# EAGLE design 618_can_switch (EAGLE 9.5.1)
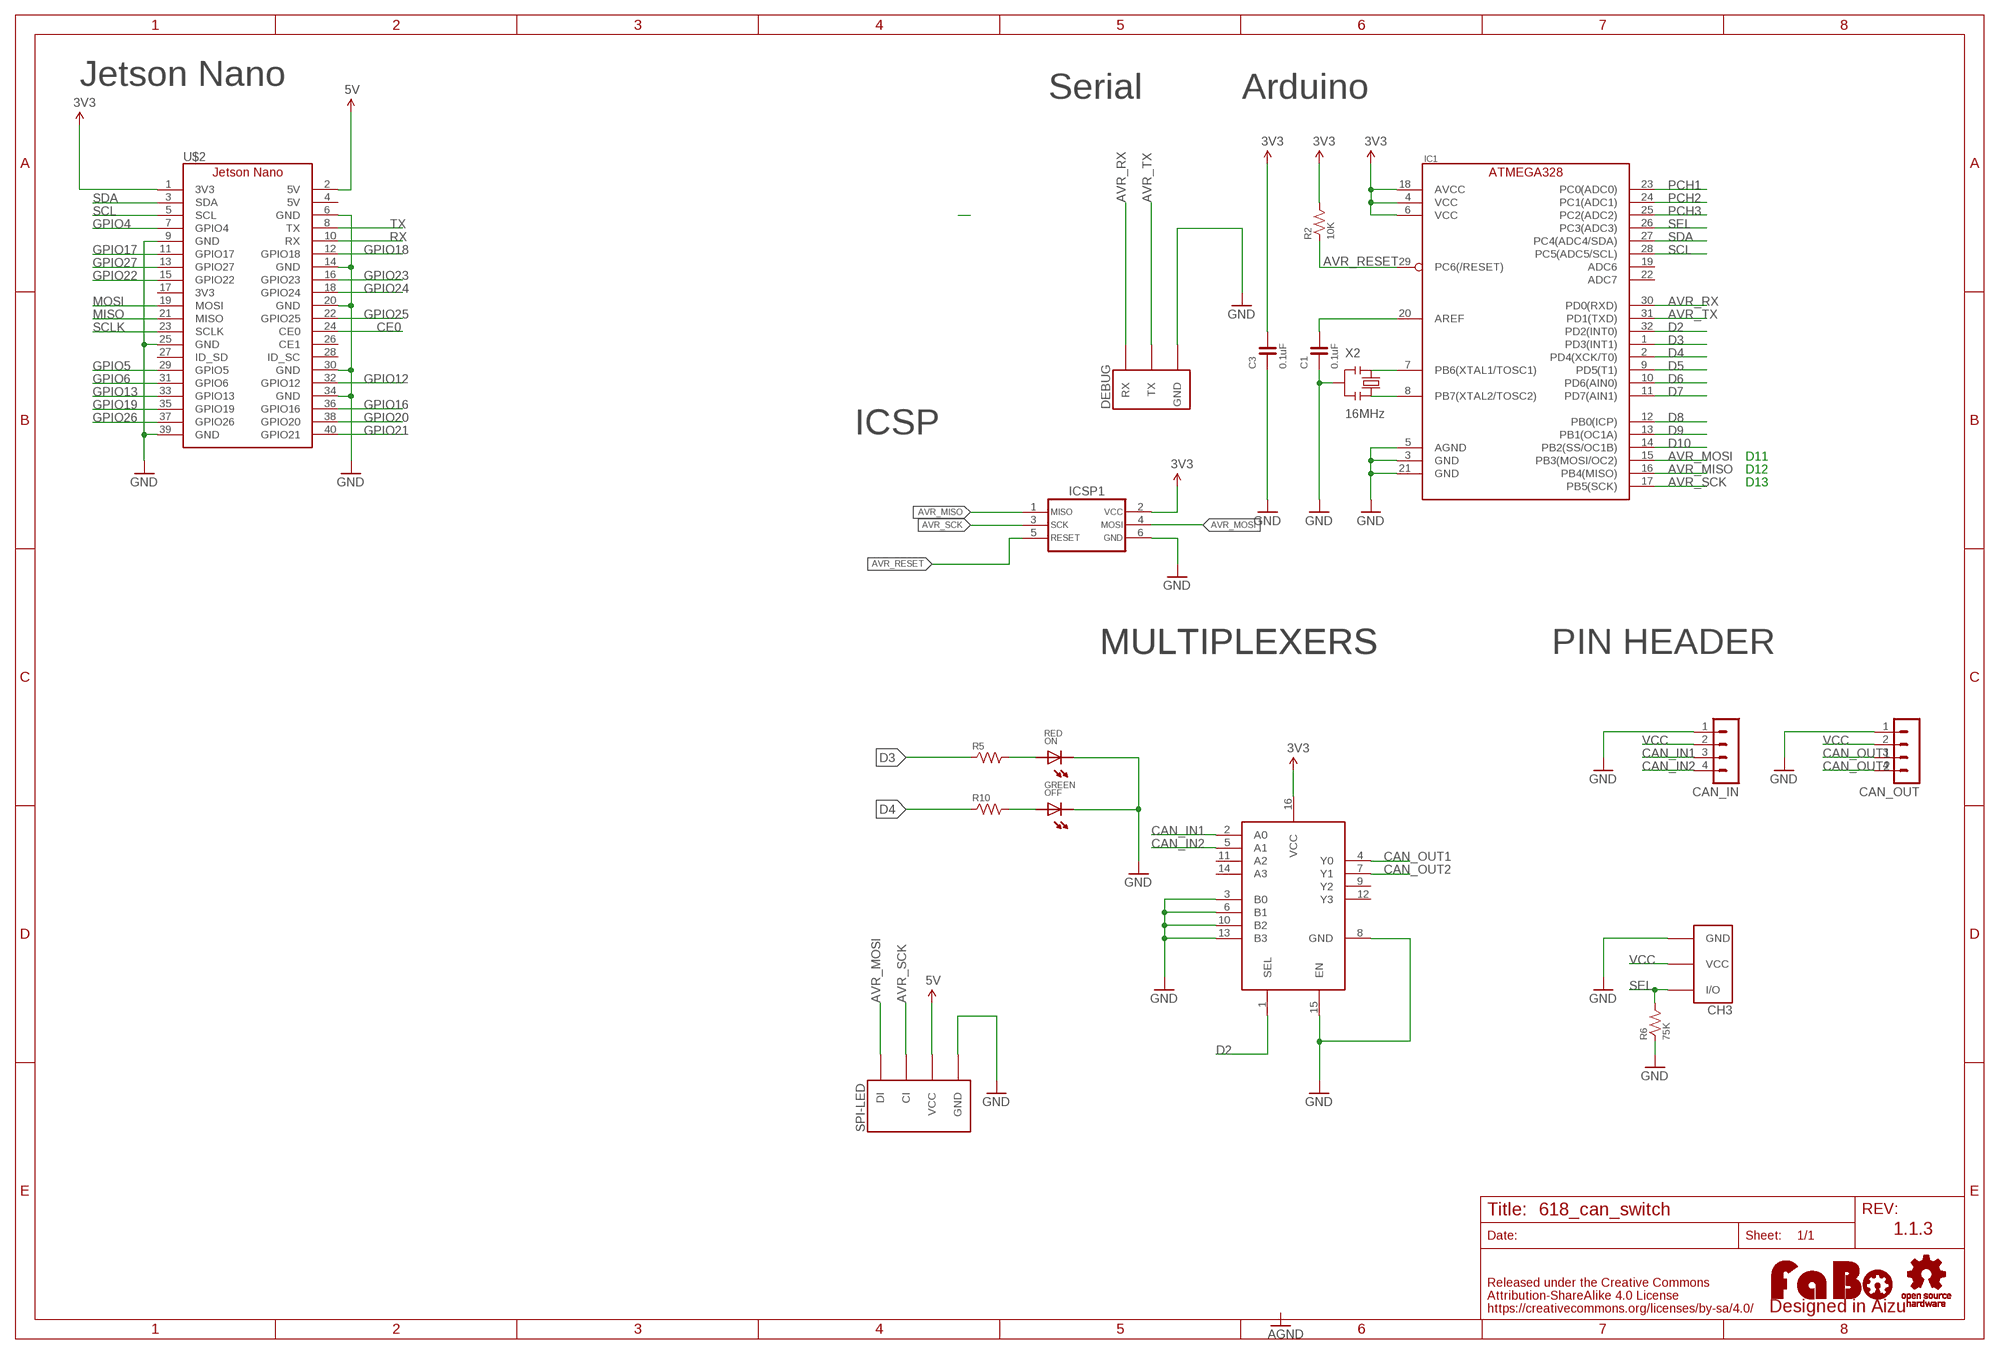
[diagram p0: schematic, sheet 1]

## Parts
C1  0.1uF  CAPACITOR-0603  [0603]
C3  0.1uF  CAPACITOR-0603  [0603]
CAN_IN  MA04-1  [MA04-1]
CAN_OUT  MA04-1  [MA04-1]
CH3  FABO_BRICK_3PIN-HEADER  [FABO_BRICK_3PIN_HEADER]
DEBUG  FABO_BRICK_3PIN_DEBUG  [FABO_BRICK_3PIN_DEBUG]
IC1  ATMEGA328P-AU  [TQFP-32]
IC3  MULTIPLEXERSMC74HC157A  [TSSOP-16]
ICSP1  ICSP_AVR-TC_NOHOLE  [TC2030]
LOGO1  LOGO_FABO-S  [LOGO_FABO_S]
OFF  GREEN  LED-0603  [0603]
ON  RED  LED-0603  [0603]
R2  10K  RESISTOR-0603  [0603]
R5  220  RESISTOR-0603  [0603]
R6  75K  RESISTOR-0603  [0603]
R10  220  RESISTOR-0603  [0603]
SPI-LED  FABO-SPI-LED-B04B  [SPI-B04B-PASK-1]
U$2  JETSON_NANO_NOBORDER  [JETSON_NANO_NOBOARDER]
U$7  LOGO_OSHW-M_BOTTOM  [LOGO_OSHW_M_BOTTOM]
X2  16MHz  RESONATOR  [CSTNE_V_C]

## Nets
3V3: C3.2 IC1.4(VCC) IC1.6(VCC) IC1.18(AVCC) IC3.16(VCC) ICSP1.2 R2.2 U$2.1(3V3)
5V: SPI-LED.VCC U$2.2(5V)
AVR_MISO: IC1.16(PB4(MISO)) ICSP1.1
AVR_MOSI: IC1.15(PB3(MOSI/OC2)) ICSP1.4 SPI-LED.DI
AVR_RESET: IC1.29(PC6(/RESET)) ICSP1.5 R2.1
AVR_RX: DEBUG.RX IC1.30(PD0(RXD))
AVR_SCK: IC1.17(PB5(SCK)) ICSP1.3 SPI-LED.CI
AVR_TX: DEBUG.TX IC1.31(PD1(TXD))
CAN_IN1: CAN_IN.3 IC3.2(A0)
CAN_IN2: CAN_IN.4 IC3.5(A1)
CAN_OUT1: CAN_OUT.3 IC3.4(Y0)
CAN_OUT2: CAN_OUT.4 IC3.7(Y1)
CE0: U$2.24(CE0)
D2: IC1.32(PD2(INT0)) IC3.1(SEL)
D3: IC1.1(PD3(INT1)) R5.1
D4: IC1.2(PD4(XCK/T0)) R10.1
D5: IC1.9(PD5(T1))
D6: IC1.10(PD6(AIN0))
D7: IC1.11(PD7(AIN1))
D8: IC1.12(PB0(ICP))
D9: IC1.13(PB1(OC1A))
D10: IC1.14(PB2(SS/OC1B))
GND: C1.1 C3.1 CAN_IN.1 CAN_OUT.1 CH3.GND DEBUG.GND IC1.3(GND) IC1.5(AGND) IC1.21(GND) IC3.3(B0) IC3.6(B1) IC3.8(GND) IC3.10(B2) IC3.13(B3) IC3.15(EN) ICSP1.6 OFF.CATHODE ON.CATHODE R6.1 SPI-LED.GND U$2.6(GND) U$2.9(GND) U$2.14(GND) U$2.20(GND) U$2.25(GND) U$2.30(GND) U$2.34(GND) U$2.39(GND) X2.2
GPIO4: U$2.7(GPIO4)
GPIO5: U$2.29(GPIO5)
GPIO6: U$2.31(GPIO6)
GPIO12: U$2.32(GPIO12)
GPIO13: U$2.33(GPIO13)
GPIO16: U$2.36(GPIO16)
GPIO17: U$2.11(GPIO17)
GPIO18: U$2.12(GPIO18)
GPIO19: U$2.35(GPIO19)
GPIO20: U$2.38(GPIO20)
GPIO21: U$2.40(GPIO21)
GPIO22: U$2.15(GPIO22)
GPIO23: U$2.16(GPIO23)
GPIO24: U$2.18(GPIO24)
GPIO25: U$2.22(GPIO25)
GPIO26: U$2.37(GPIO26)
GPIO27: U$2.13(GPIO27)
MISO: U$2.21(MISO)
MOSI: U$2.19(MOSI)
N$4: C1.2 IC1.20(AREF)
N$5: IC1.8(PB7(XTAL2/TOSC2)) X2.3
N$15: IC1.7(PB6(XTAL1/TOSC1)) X2.1
N$19: ON.ANODE R5.2
N$20: OFF.ANODE R10.2
PCH1: IC1.23(PC0(ADC0))
PCH2: IC1.24(PC1(ADC1))
PCH3: IC1.25(PC2(ADC2))
RX: U$2.10(RX)
SCL: IC1.28(PC5(ADC5/SCL)) U$2.5(SCL)
SCLK: U$2.23(SCLK)
SDA: IC1.27(PC4(ADC4/SDA)) U$2.3(SDA)
SEL: CH3.I/O IC1.26(PC3(ADC3)) R6.2
TX: U$2.8(TX)
VCC: CAN_IN.2 CAN_OUT.2 CH3.VCC
Unconnected: IC1.19(ADC6) IC1.22(ADC7) IC3.9(Y2) IC3.11(A2) IC3.12(Y3) IC3.14(A3) U$2.4(5V) U$2.17(3V3) U$2.26(CE1) U$2.27(ID_SD) U$2.28(ID_SC)

## Notes on the sheet
- Jetson Nano
- Serial | Arduino
- ICSP
- D11
- D12
- D13
- MULTIPLEXERS | MULTIPLEXERS | PIN HEADER
- 1.1.3

## Library data of the parts
C1 C3 = FaBo-Capacitor:CAPACITOR: CAPACITOR
CAN_IN CAN_OUT = con-lstb:MA04-1: PIN HEADER; OC_FARNELL: unknown; OC_NEWARK: unknown
CH3 = FaBo-Template:FABO_BRICK_3PIN: FaBo Brick 3pin
DEBUG = FaBo-Template:FABO_BRICK_3PIN_DEBUG
IC1 = component:ATMEGA328
IC3 = FaBo-Multiplexers:MULTIPLEXERS
ICSP1 = component:ICSP_AVR
LOGO1 = component:LOGO_FABO
OFF ON = FaBo-LED:LED
R2 R5 R6 R10 = FaBo-Resistors:RESISTOR: RESISTOR
SPI-LED = FaBo-Connetor:FABO-SPI-LED
U$2 = FaBo-Boards:JETSON_NANO
U$7 = FaBo-Logo:LOGO_OSHW
X2 = component:RESONATOR

## Board
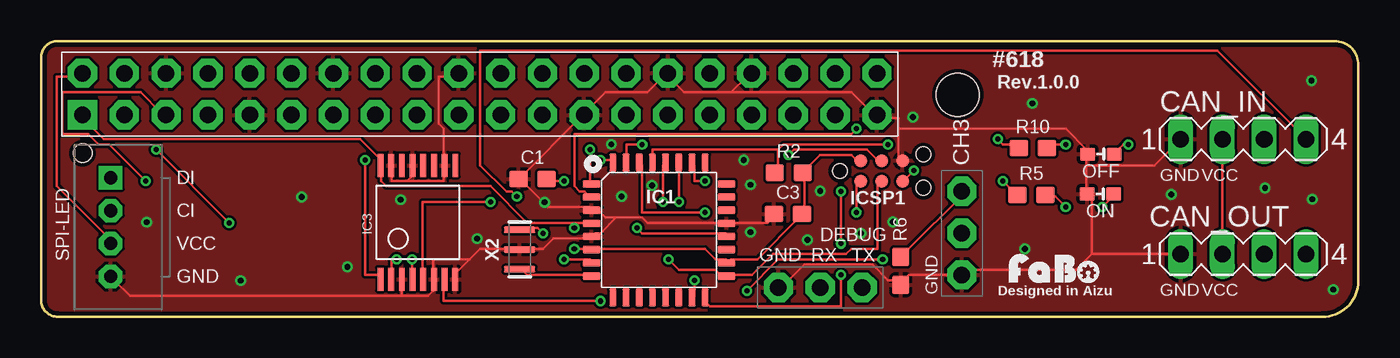
[diagram p1: board, top side]
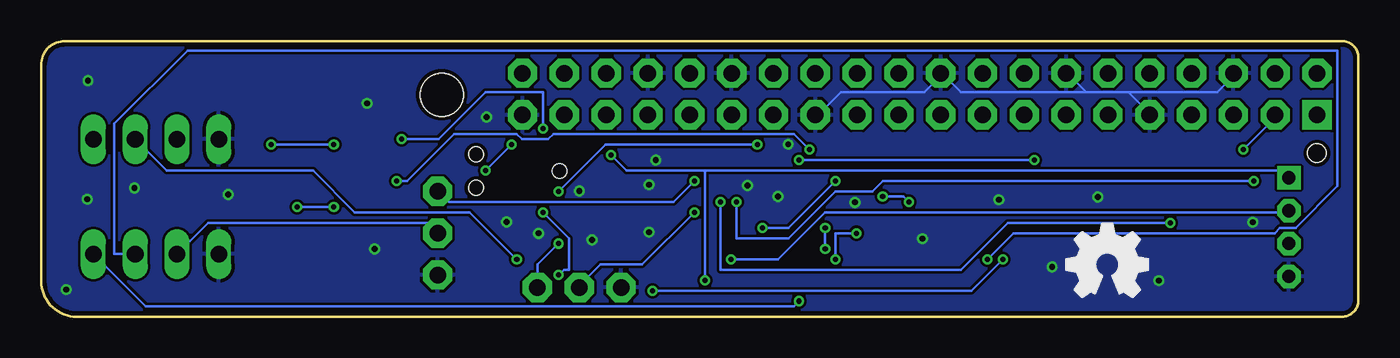
[diagram p2: board, bottom side, seen from below]

Size 80.01 x 16.76 mm. Coordinates in mm from the lower left corner, seen from the top.
Outline: 1,16.76 78.56,16.76 arc-90 80.01,15.31 80.01,2.17 arc-90 77.84,0 1,0 arc-90 0,1 0,15.76 arc-90 1,16.76
Copper layers (1*16): Top 0.035mm / dielectric 1.6mm / Bottom 0.035mm
Design rules "PCBway": minimum track width 6mil, minimum drill 12mil, track to track 6mil, track to pad 6mil, pad to pad 6mil, via to via 6mil, smd to smd 6mil, copper to edge 10mil, drill to drill 10mil, minimum pad ring 10mil, minimum via ring 6mil, stop-mask expansion 2mil, vias tented up to drill 100mil, thermal gap 8mil
Holes 2.6 mm at 55.68,13.51

### Footprints (pad centres in the part's own frame; a part is rotated, then mirrored left to right if it is on the bottom)
0603 = smd 1.1 x 1: 1 -0.85,0; 2 0.85,0
MA04-1 = drill 1.016 long: 1 -3.81,0; 2 -1.27,0; 3 1.27,0; 4 3.81,0
FABO_BRICK_3PIN_HEADER = drill 1 pad 1.778 octagon: GND -2.54,0; I/O 2.54,0; VCC 0,0
FABO_BRICK_3PIN_DEBUG = drill 1 pad 1.778 octagon: GND -2.54,0; RX 0,0; TX 2.54,0
TQFP-32 = smd 1.1 x 0.45: 1 -4.1,2.8; 2 -4.1,2; 3 -4.1,1.2; 4 -4.1,0.4; 5 -4.1,-0.4; 6 -4.1,-1.2; 7 -4.1,-2; 8 -4.1,-2.8; 17 4.1,-2.8; 18 4.1,-2; 19 4.1,-1.2; 20 4.1,-0.4; 21 4.1,0.4; 22 4.1,1.2; 23 4.1,2; 24 4.1,2.8 | smd 0.45 x 1.1: 9 -2.8,-4.1; 10 -2,-4.1; 11 -1.2,-4.1; 12 -0.4,-4.1; 13 0.4,-4.1; 14 1.2,-4.1; 15 2,-4.1; 16 2.8,-4.1; 25 2.8,4.1; 26 2,4.1; 27 1.2,4.1; 28 0.4,4.1; 29 -0.4,4.1; 30 -1.2,4.1; 31 -2,4.1; 32 -2.8,4.1
TSSOP-16 = smd 0.36 x 1.397: 1 -2.275,-3.469; 2 -1.625,-3.469; 3 -0.975,-3.469; 4 -0.325,-3.469; 5 0.325,-3.469; 6 0.975,-3.469; 7 1.625,-3.469; 8 2.271,-3.469; 9 2.275,3.458; 10 1.625,3.458; 11 0.971,3.458; 12 0.325,3.458; 13 -0.325,3.458; 14 -0.975,3.458; 15 -1.625,3.458; 16 -2.275,3.458
TC2030 = smd 0.787 x 0.787: 1 1.27,-0.635; 2 1.27,0.635; 3 2.54,-0.635; 4 2.54,0.635; 5 3.81,-0.635; 6 3.81,0.635 | hole 0.889: 0,0; 5.08,-1.016; 5.08,1.016
0603' = smd 0.9 x 0.8: ANODE -0.8,0; CATHODE 0.8,0
SPI-B04B-PASK-1 = drill 0.8 pad 1.422 octagon: CI 1,1.27; GND -3,1.27; VCC -1,1.27 | drill 0.8 pad 1.422 square: DI 3,1.27 | hole 1.1: 4.5,2.97
JETSON_NANO_NOBOARDER = drill 1 pad 1.778 square: 1 1.27,1.27 | drill 1 pad 1.778 octagon: 2 1.27,3.81; 3 3.81,1.27; 4 3.81,3.81; 5 6.35,1.27; 6 6.35,3.81; 7 8.89,1.27; 8 8.89,3.81; 9 11.43,1.27; 10 11.43,3.81; 11 13.97,1.27; 12 13.97,3.81; 13 16.51,1.27; 14 16.51,3.81; 15 19.05,1.27; 16 19.05,3.81; 17 21.59,1.27; 18 21.59,3.81; 19 24.13,1.27; 20 24.13,3.81; 21 26.67,1.27; 22 26.67,3.81; 23 29.21,1.27; 24 29.21,3.81; 25 31.75,1.27; 26 31.75,3.81; 27 34.29,1.27; 28 34.29,3.81; 29 36.83,1.27; 30 36.83,3.81; 31 39.37,1.27; 32 39.37,3.81; 33 41.91,1.27; 34 41.91,3.81; 35 44.45,1.27; 36 44.45,3.81; 37 46.99,1.27; 38 46.99,3.81; 39 49.53,1.27; 40 49.53,3.81
CSTNE_V_C = smd 0.4 x 1.9: 1 1.2,0; 2 0,0; 3 -1.2,0

### Placement (x,y rotation side)
C1  29.85,8.39 0 top
C3  45.37,6.25 0 top
CAN_IN  73.03,10.8 0 top
CAN_OUT  73.03,3.81 0 top
CH3  55.92,5.08 90 top
DEBUG  47.33,1.78 0 top
IC1  37.53,5.28 0 top
IC3  22.89,5.75 0 top
ICSP1  48.52,8.86 0 top
LOGO1  61.59,1.91 0 top
OFF  GREEN  [0603']  64.37,9.89 180 top
ON  RED  [0603']  64.34,7.47 180 top
R2  45.41,8.76 0 top
R5  60.14,7.41 0 top
R6  52.22,2.79 90 top
R10  60.24,10.25 0 top
SPI-LED  5.49,5.45 90 top
U$2  1.24,11 0 top
U$7  15.24,3.17 0 top
X2  29.07,4.08 90 top

### Tracks (layer width: path | path; a pad name or v marks a point on that pad's centre or on a via)
3V3  (via drill 0.3)
  Top 0.152: ICSP1.2 49.53,9.52 49.21,9.84 47.31,9.84 46.36,8.89 R2.2 46.36,8.57 46.36,6.35 C3.2 46.04,6.03 43.5,3.49 41.91,3.49 IC1.18 41.59,3.49 40.96,3.49 40.32,4.13 33.66,4.13 IC1.6 33.34,4.13 v32.39,4.13 | 32.39,5.72 29.53,5.72 27.3,7.94 20.96,7.94 20.64,8.25 20.64,8.89 IC3.16 20.64,9.21 20.64,9.52 19.37,10.8 3.81,10.8 2.54,12.07 U$2.1 | 32.39,5.72 33.34,5.72 IC1.4 | 32.39,5.72 v32.39,5.4
  Bottom 0.152: v32.39,5.4 v32.39,4.13
5V
  Top 0.152: SPI-LED.VCC 4.13,4.76 0.95,7.94 0.95,14.61 2.22,14.61 U$2.2
AVR_MISO  (via drill 0.3)
  Top 0.152: v49.53,6.35 49.53,7.94 ICSP1.1 | v48.58,2.54 48.58,0.63 40.64,0.63 40.32,0.95 IC1.16
  Bottom 0.152: v49.53,6.35 47.94,4.76 47.94,2.86 48.26,2.86 v48.58,2.54
AVR_MOSI  (via drill 0.3)
  Top 0.152: v45.4,9.84 45.72,10.16 50.17,10.16 50.8,9.52 ICSP1.4 | v39.69,2.22 39.69,1.27 IC1.15
  Bottom 0.152: v45.4,9.84 44.45,8.89 39.69,8.89 | 39.69,8.89 4.76,8.89 4.45,8.57 SPI-LED.DI | 39.69,8.89 v39.69,2.22
AVR_RESET  (via drill 0.3)
  Top 0.152: v53.02,8.89 52.39,8.25 ICSP1.5 | v51.44,10.48 45.09,10.48 44.77,10.16 | 44.77,10.16 44.77,8.89 R2.1 | 44.77,10.16 37.15,10.16 37.15,9.52 IC1.29
  Bottom 0.152: v51.44,10.48 v53.02,8.89
AVR_RX  (via drill 0.3)
  Top 0.152: v40.32,6.35 36.51,6.35 36.51,9.21 IC1.30
  Bottom 0.152: v40.32,6.35 43.5,3.17 46.04,3.17 47.31,1.91 DEBUG.RX
AVR_SCK  (via drill 0.3)
  Top 0.152: ICSP1.3 50.8,7.94 50.8,4.13 49.21,4.13 48.89,3.81 44.45,3.81 43.18,2.54 41.91,2.54 IC1.17 41.59,2.54 41.28,2.54 40.96,2.86 38.73,2.86 v38.1,3.49
  Bottom 0.152: v38.1,3.49 35.24,3.49 32.39,6.35 4.45,6.35 SPI-LED.CI
AVR_TX  (via drill 0.3)
  Top 0.152: v36.51,10.48 35.56,10.48 35.56,9.52 IC1.31 | v48.58,4.45 v48.58,7.62
  Bottom 0.152: v36.51,10.48 45.72,10.48 v48.58,7.62 | v48.58,4.45 49.85,3.17 49.85,1.91 DEBUG.TX
CAN_IN1  (via drill 0.3)
  Top 0.152: v21.59,3.49 21.27,3.49 21.27,2.54 IC3.2 | v42.86,1.59 44.77,3.49 v51.12,3.49
  Bottom 0.152: v21.59,3.49 23.5,1.59 v42.86,1.59 | v51.12,3.49 53.98,6.35 60.96,6.35 63.5,8.89 72.39,8.89 CAN_IN.3
CAN_IN2  (via drill 0.3)
  Top 0.152: v27.3,6.99 23.18,6.99 23.18,2.54 IC3.5 | v28.89,7.3 28.57,7.62 28.26,7.62 26.67,9.21 26.67,16.19 71.44,16.19 CAN_IN.4
  Bottom 0.152: v27.3,6.99 27.62,7.3 v28.89,7.3
CAN_OUT1  (via drill 0.3)
  Top 0.152: v22.54,3.49 22.54,2.54 IC3.4
  Bottom 0.152: v22.54,3.49 20.96,5.08 5.08,5.08 4.76,5.4 3.81,5.4 1.27,7.94 1.27,16.19 71.12,16.19 75.56,11.75 75.56,3.81 CAN_OUT.3
CAN_OUT2  (via drill 0.3)
  Top 0.152: v33.97,0.95 24.45,0.95 24.45,2.22 IC3.7
  Bottom 0.152: v33.97,0.95 34.29,0.63 73.66,0.63 CAN_OUT.4
D2  (via drill 0.3)
  Top 0.152: v33.97,9.52 34.61,9.52 IC1.32 | v19.68,9.52 19.68,2.54 20.64,2.54 IC3.1
  Bottom 0.152: v19.68,9.52 v33.97,9.52
D3  (via drill 0.3)
  Top 0.152: v33.34,10.16 33.34,8.25 IC1.1 | v58.42,8.25 59.06,7.62 R5.1
  Bottom 0.152: v33.34,10.16 34.29,11.11 48.89,11.11 49.21,10.8 50.8,10.8 51.12,11.11 54.93,11.11 57.78,8.25 v58.42,8.25
D4  (via drill 0.3)
  Top 0.152: v49.53,11.43 49.21,11.11 32.39,11.11 32.39,7.94 32.7,7.62 33.02,7.62 33.34,7.3 IC1.2 | v58.1,10.8 58.42,10.48 59.37,10.48 R10.1
  Bottom 0.152: v49.53,11.43 49.53,13.65 53.02,13.65 55.88,10.8 v58.1,10.8
GND  (via drill 0.35)
  Top 0.152: 63.5,9.21 63.5,9.84 OFF.CATHODE 63.5,10.16 62.23,11.43 52.07,11.43 | 63.5,9.21 63.5,7.62 ON.CATHODE 63.82,7.3 63.82,3.81 | CAN_OUT.1 63.82,3.81 | CAN_IN.1 67.63,9.21 63.5,9.21 | DEBUG.GND 45.09,1.91 46.36,3.17 50.48,3.17 51.44,2.22 52.07,2.22 R6.1 52.39,2.22 52.7,2.54 55.88,2.54 CH3.GND 56.2,2.86 62.87,2.86 63.82,3.81 | 21.91,1.27 21.91,2.22 IC3.3 | 21.91,1.27 23.5,1.27 23.81,1.59 23.81,2.22 IC3.6 23.81,2.54 23.81,3.49 26.04,3.49 | 26.04,3.49 26.67,4.13 28.89,4.13 X2.2 29.21,4.13 30.48,4.13 31.11,4.76 33.34,4.76 IC1.5 33.66,5.08 33.97,5.08 34.92,6.03 | 26.04,3.49 25.08,2.54 IC3.8 | 21.91,1.27 5.4,1.27 4.45,2.22 SPI-LED.GND | 22.22,8.25 21.27,8.25 21.27,8.89 IC3.15 | 22.22,8.25 22.54,8.57 22.54,8.89 IC3.13 | 22.22,8.25 24.45,8.25 24.45,8.89 IC3.10 24.45,9.21 24.45,11.43 24.13,11.75 24.13,14.61 25.08,14.61 U$2.20 | 52.07,11.43 52.07,12.07 50.8,12.07 U$2.39 50.48,12.38 49.21,13.65 41.91,13.65 | 52.07,11.43 52.07,9.52 ICSP1.6 | 41.91,13.65 39.05,13.65 38.1,14.61 U$2.30 37.78,14.61 36.83,13.65 34.29,13.65 33.02,12.38 U$2.25 32.7,12.07 29.21,8.57 C1.1 29.21,8.25 30.8,6.67 33.34,6.67 IC1.3 33.66,6.35 33.97,6.35 34.29,6.03 34.92,6.03 | 41.91,13.65 42.86,14.61 U$2.34 | C3.1 44.45,6.03 44.13,5.72 41.91,5.72 IC1.21 41.59,5.72 36.83,5.72 36.51,6.03 34.92,6.03
  Bottom 0.152: 13.97,13.65 12.7,12.38 U$2.9 | 16.51,13.65 13.97,13.65 | 16.51,13.65 17.46,14.61 U$2.14 | 13.97,13.65 8.57,13.65 7.62,14.61 U$2.6 | 16.51,13.65 24.13,13.65 25.08,14.61 U$2.20 25.4,14.61 26.35,13.65 31.43,13.65 32.7,12.38 U$2.25
  other vias: 26.48,4.74 21.84,7.12 18.61,3.03 30.57,6.96 35.26,7.31 6.4,5.74 12.11,2.2 15.82,7.29 43.08,5.15 43.08,8.03 47.32,7.65 46.56,4.67 49.79,5.07 51.74,5.77 52.95,12.14 59.76,4.12 60.21,12.98 68.66,7.43 74.34,7.84 77.22,7.15 77.17,14.36 78.48,1.65 42.68,9.52 34.63,10.48 37.1,7.98
  pour Top: 0,0 0,17.14 80.01,17.14 80.01,0
  pour Bottom: 0,0 0,17.14 80.01,17.14 80.01,0
N$4  (via drill 0.3)
  Top 0.152: v31.75,8.25 30.8,8.25 C1.2 | v36.19,5.4 36.51,5.08 41.59,5.08 IC1.20
  Bottom 0.152: v31.75,8.25 34.61,5.4 v36.19,5.4
N$5
  Top 0.152: IC1.8 33.34,2.54 29.53,2.54 29.21,2.86 X2.3
N$15  (via drill 0.3)
  Top 0.152: v31.75,3.49 33.34,3.49 IC1.7 | v30.48,5.08 30.16,5.4 29.21,5.4 X2.1
  Bottom 0.152: v31.75,3.49 31.75,5.08 v30.48,5.08
N$19  (via drill 0.3)
  Top 0.152: v64.45,6.67 65.09,7.3 ON.ANODE | v62.23,6.67 61.59,7.3 61.28,7.3 R5.2
  Bottom 0.152: v62.23,6.67 v64.45,6.67
N$20  (via drill 0.3)
  Top 0.152: v66.04,10.48 65.72,10.48 65.41,10.16 OFF.ANODE | v62.23,10.48 61.28,10.48 R10.2
  Bottom 0.152: v62.23,10.48 v66.04,10.48
SCL  (via drill 0.3)
  Top 0.152: v37.78,6.99 37.78,9.21 IC1.28 | v6.35,8.25 4.13,10.48 3.49,10.48 2.86,11.11 1.27,11.11 1.27,13.65 6.03,13.65 7.3,12.38 U$2.5
  Bottom 0.152: v37.78,6.99 37.78,4.76 34.61,4.76 31.75,7.62 29.53,7.62 28.89,8.25 v6.35,8.25
SDA  (via drill 0.3)
  Top 0.152: v38.73,6.99 38.73,9.21 IC1.27 | v6.98,10.16 v11.43,5.72
  Bottom 0.152: v38.73,6.99 38.73,2.86 24.13,2.86 21.27,5.72 v11.43,5.72 | v6.98,10.16 5.08,12.07 U$2.3
SEL  (via drill 0.3)
  Top 0.152: v40.32,8.25 39.69,8.25 39.69,9.21 IC1.26 | R6.2 52.39,3.81 56.2,7.62 CH3.I/O
  Bottom 0.152: v40.32,8.25 41.59,6.99 55.25,6.99 55.88,7.62 CH3.I/O
VCC
  Top 0.152: CAN_IN.2 CAN_OUT.2
  Bottom 0.152: CAN_OUT.2 69.85,5.72 56.52,5.72 56.2,5.4 CH3.VCC

### Text on the board
tPlace: #618 | Rev.1.0.0 | GND | VCC | GND | RX | TX | GND | Designed in Aizu | GND | VCC